# Altium schematic sheet Mother_board_slot.SchDoc
size 209 x 297 mm; PageSetup: Record=PageOptions|CenterHorizontal=True|CenterVertical=True|PrintScale=1.00|XCorrection=1.00|YCorrection=1.00|PrintKind=1|BorderSize=5000000|LeftOffset=0|BottomOffset=0|Orientation=2|PaperLength=1000|PaperWidth=1000|Scale=100|PaperSource=15|PrintQuality=1200|MediaType=1|DitherType=10|PaperKind=A3|PrintScaleMode=1; Weight: -; ScaleFactor: -; NormInspection: Норм.Контр.
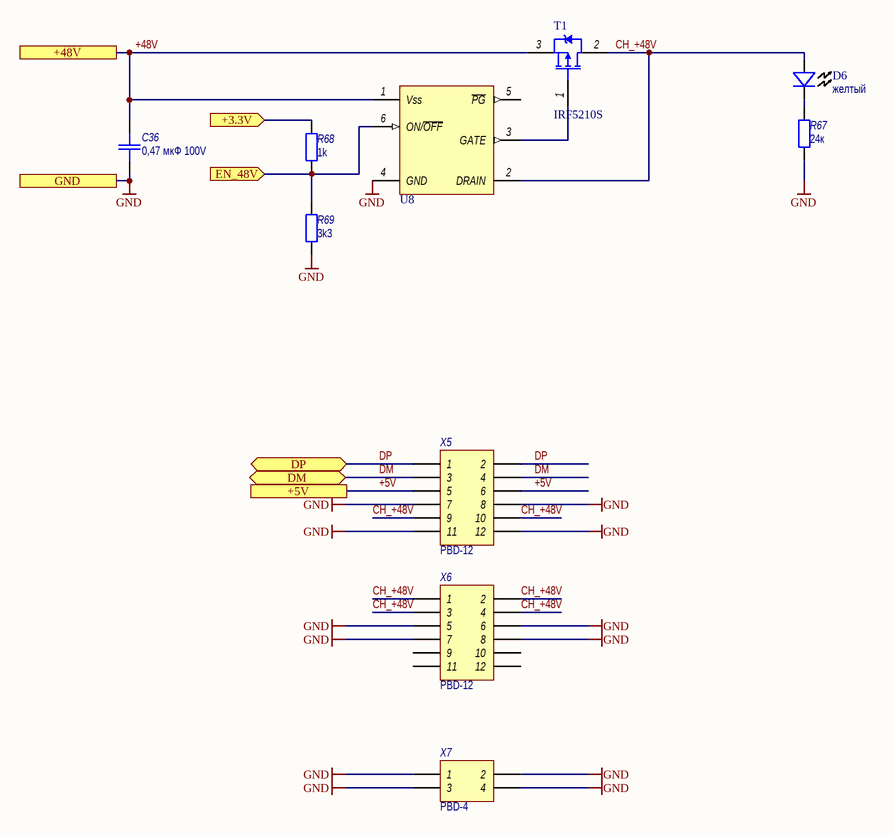
[diagram p0: Mother_board_slot.SchDoc]

## Parts
C36  0,47 мкФ 100V  [SMD_0805]
D6  value желтый  [LED-0805]  (hidden comment: LED)
R67  24к  [SMD_0805]
R68  1k  [SMD_0805]
R69  3k3  [SMD_0805]
T1  IRF5210S  [D2Pak]
U8  MAX5902  [SOT23-6]  (value not drawn)
X5  Header 2X12  [PBD-12]  (value not drawn)
X6  Header 2X12  [PBD-12]  (value not drawn)
X7  Header 2X4  [PBD-4]  (value not drawn)

## Ports
+3.3V (in), +5V, +48V, DM (bidir), DP (bidir), EN_48V (in), GND

## Nets
GND: C36.1 R67.1 R69.1 U8.4(GND) X5.7 X5.8 X5.11 X5.12 X6.5 X6.6 X6.7 X6.8 X7.1 X7.2 X7.3 X7.4 ; port GND
+3.3V: R68.1 ; port +3.3V
+5V: X5.5 X5.6 ; port +5V
+48V: C36.2 T1.3(S) U8.1(Vss) ; port +48V
CH_+48V: D6.1(A) T1.2(D) U8.2(DRAIN) X5.9 X5.10 X6.1 X6.2 X6.3 X6.4
DM: X5.3 X5.4 ; port DM
DP: X5.1 X5.2 ; port DP
EN_48V: R68.2 R69.2 U8.6(ON/~{OFF}) ; port EN_48V
NetD6_2: D6.2(K) R67.2
NetT1_1: T1.1(G) U8.3(GATE)

Not connected (* = marked no-connect by the designer): U8 5(~{PG}); X6 9 10 11 12

## Notes on the sheet
- Перв. примен.
- Справ. №
- Подп. и дата
- Инв. № дубл.
- Взам. инв. №
- Разраб.
- Изм.
- Лист
- № докум.
- Подп.
- Дата
- Литера
- Масса
- Масштаб
- Пров.
- Т.контр.
- Листов
- Инв. № подл.
- Н.контр.
- Утв.
- Форма 1 ГОСТ 2.104-2006
- Копировал
- Формат А4

## Library data of the parts
C36 = Capacitor: Назначение: SMD-конденсатор; Наименование: Конденсатор; Потребление, Вт: 0; Value: 0,47 мкФ 100V
D6 = LED: Назначение: Светодиод; Наименование: SMD-LED; Потребление, Вт: 0,01
R67-R69 = Resistor: Наименование: Резистор; Назначение: SMD-резистор; Потребление, Вт: 0,001
  R67: Value: 24к
  R68: Value: 1k
  R69: Value: 3k3
T1 = IRF5210S: P channel Power MosFET; Назначение: Транзистор P канальный; Потребление, Вт: 0,02; Наименование: IRF5210S
U8 = MAX5902: Hot-swap controller; Package Information: Latest Revision: ver11.0, Feb-2003; Configures: APEX II, APEX 20K, Mercury, ACEX 1K & FLEX Devices; Code - JEDEC: MS-026-ABA; Назначение: Драйвер верхнего плеча, драйвер P транзистора; Потребление, Вт: 0,01; Published: 17-Sep-2003; Datasheet: Latest Revision: ver1.1, Oct-2003; Package Reference: TQFP32; Publisher: Altium Limited; Наименование: MAX5902
X5 X6 = Header 2X12: Header, 12-Pin, Dual row; Потребление, Вт: 0,0; Назначение: Header, 12-Pin, Dual row; Наименование: PBD-12
X7 = Header 2X4: Header, 4-Pin, Dual row; Потребление, Вт: 0,0; Назначение: Header, 4-Pin, Dual row; Наименование: PBD-4